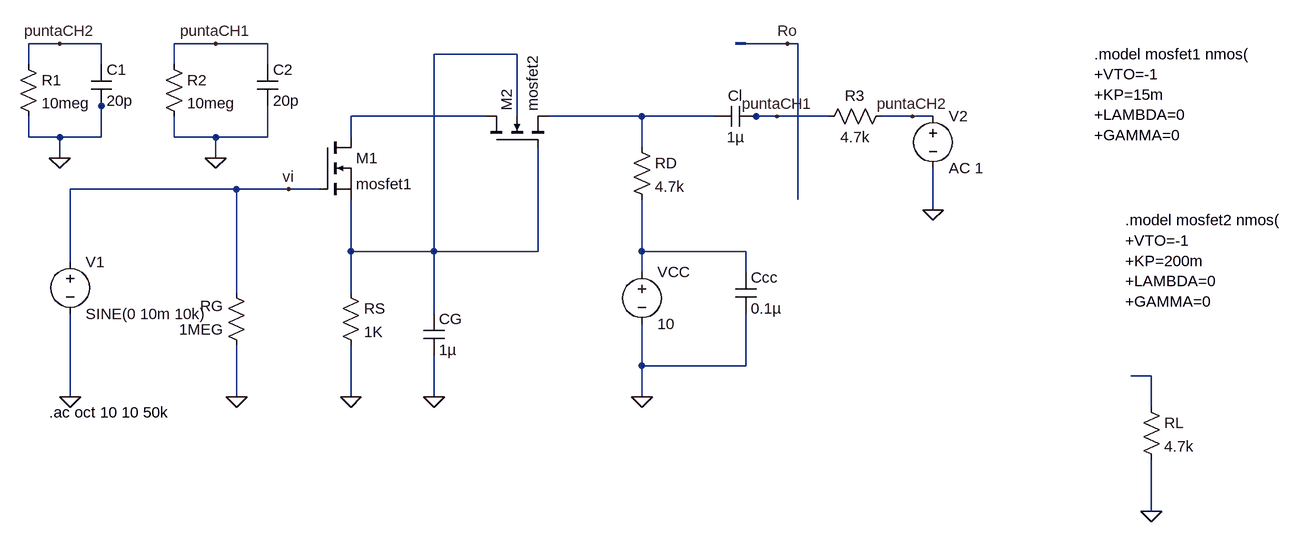
[diagram p0: schematic Ro.asc]
Ro.asc, the LTspice schematic file:
Version 4
SHEET 1 2100 680
WIRE -240 -192 -288 -192
WIRE -176 -192 -240 -192
WIRE 0 -192 -64 -192
WIRE 80 -192 0 -192
WIRE 880 -192 816 -192
WIRE 896 -192 880 -192
WIRE 464 -176 336 -176
WIRE -288 -160 -288 -192
WIRE -176 -160 -176 -192
WIRE -64 -160 -64 -192
WIRE 80 -160 80 -192
WIRE -176 -96 -176 -112
WIRE 416 -80 208 -80
WIRE 464 -80 464 -176
WIRE 656 -80 512 -80
WIRE 768 -80 656 -80
WIRE 832 -80 816 -80
WIRE 864 -80 832 -80
WIRE 944 -80 864 -80
WIRE 1072 -80 1024 -80
WIRE 1104 -80 1072 -80
WIRE -288 -48 -288 -80
WIRE -240 -48 -288 -48
WIRE -176 -48 -176 -96
WIRE -176 -48 -240 -48
WIRE -64 -48 -64 -80
WIRE 0 -48 -64 -48
WIRE 80 -48 80 -96
WIRE 80 -48 0 -48
WIRE 208 -48 208 -80
WIRE 656 -32 656 -80
WIRE -240 -16 -240 -48
WIRE 0 -16 0 -48
WIRE 32 32 -224 32
WIRE 112 32 32 32
WIRE 160 32 112 32
WIRE 896 48 896 -192
WIRE 1104 64 1104 0
WIRE 208 128 208 48
WIRE 336 128 336 -176
WIRE 336 128 208 128
WIRE 496 128 496 -32
WIRE 496 128 336 128
WIRE 656 128 656 48
WIRE 816 128 656 128
WIRE -224 144 -224 32
WIRE 656 160 656 128
WIRE 816 160 816 128
WIRE 32 192 32 32
WIRE 208 192 208 128
WIRE 336 224 336 128
WIRE 656 304 656 240
WIRE 816 304 816 224
WIRE 816 304 656 304
WIRE 1440 320 1408 320
WIRE -224 352 -224 224
WIRE 32 352 32 272
WIRE 208 352 208 272
WIRE 336 352 336 288
WIRE 656 352 656 304
WIRE 1440 368 1440 320
WIRE 1440 528 1440 448
FLAG 32 352 0
FLAG 208 352 0
FLAG 656 352 0
FLAG 336 352 0
FLAG 1440 528 0
FLAG -224 352 0
FLAG 112 32 vi
FLAG -240 -16 0
FLAG 0 -16 0
FLAG -240 -192 puntaCH2
FLAG 0 -192 puntaCH1
FLAG 1104 64 0
FLAG 864 -80 puntaCH1
FLAG 1072 -80 puntaCH2
FLAG 880 -192 Ro
BUSTAP 816 -192 800 -192
SYMBOL res 48 288 R180
WINDOW 0 36 76 Left 2
WINDOW 3 36 40 Left 2
SYMATTR InstName RG
SYMATTR Value 1MEG
SYMBOL res 192 176 R0
SYMATTR InstName RS
SYMATTR Value 1K
SYMBOL nmos4 416 -32 R270
SYMATTR InstName M2
SYMATTR Value mosfet2
SYMBOL res 640 -48 R0
SYMATTR InstName RD
SYMATTR Value 4.7k
SYMBOL voltage 656 144 R0
SYMATTR InstName VCC
SYMATTR Value 10
SYMBOL nmos 160 -48 R0
SYMATTR InstName M1
SYMATTR Value mosfet1
SYMBOL cap 320 224 R0
SYMATTR InstName CG
SYMATTR Value 1µ
SYMBOL cap 800 160 R0
SYMATTR InstName Ccc
SYMATTR Value 0.1µ
SYMBOL cap 832 -96 R90
WINDOW 0 0 32 VBottom 2
WINDOW 3 32 32 VTop 2
SYMATTR InstName Cl
SYMATTR Value 1µ
SYMBOL res 1424 352 R0
SYMATTR InstName RL
SYMATTR Value 4.7k
SYMBOL voltage -224 128 R0
WINDOW 123 0 0 Left 2
WINDOW 39 0 0 Left 2
SYMATTR InstName V1
SYMATTR Value SINE(0 10m 10k)
SYMBOL res -304 -176 R0
SYMATTR InstName R1
SYMATTR Value 10meg
SYMBOL cap -192 -160 R0
SYMATTR InstName C1
SYMATTR Value 20p
SYMBOL res -80 -176 R0
SYMATTR InstName R2
SYMATTR Value 10meg
SYMBOL cap 64 -160 R0
SYMATTR InstName C2
SYMATTR Value 20p
SYMBOL voltage 1104 -96 R0
WINDOW 123 0 0 Left 2
WINDOW 39 0 0 Left 2
SYMATTR InstName V2
SYMATTR Value AC 1
SYMBOL res 1040 -96 R90
WINDOW 0 0 56 VBottom 2
WINDOW 3 32 56 VTop 2
SYMATTR InstName R3
SYMATTR Value 4.7k
TEXT 1352 -176 Left 2 !.model mosfet1 nmos( \n+VTO=-1 \n+KP=15m \n+LAMBDA=0 \n+GAMMA=0
TEXT 1400 80 Left 2 !.model mosfet2 nmos( \n+VTO=-1 \n+KP=200m \n+LAMBDA=0 \n+GAMMA=0
TEXT -256 376 Left 2 !.ac oct 10 10 50k

The netlist it stands for:
* Ro.asc
RG 0 vi 1MEG
RS N001 0 1K
M2 N002 N001 N003 N001 mosfet2
RD N003 N004 4.7k
VCC N004 0 10
M1 N002 vi N001 N001 mosfet1
CG N001 0 1µ
Ccc N004 0 0.1µ
Cl puntaCH1 N003 1µ
RL N005 0 4.7k
V1 vi 0 SINE(0 10m 10k)
R1 puntaCH2 0 10meg
C1 puntaCH2 0 20p
R2 puntaCH1 0 10meg
C2 puntaCH1 0 20p
V2 puntaCH2 0 AC 1
R3 puntaCH2 puntaCH1 4.7k
.model NMOS NMOS
.model PMOS PMOS
.lib standard.mos
.model mosfet1 nmos(
+VTO=-1
+KP=15m
+LAMBDA=0
+GAMMA=0
.model mosfet2 nmos(
+VTO=-1
+KP=200m
+LAMBDA=0
+GAMMA=0
.ac oct 10 10 50k
.backanno
.end